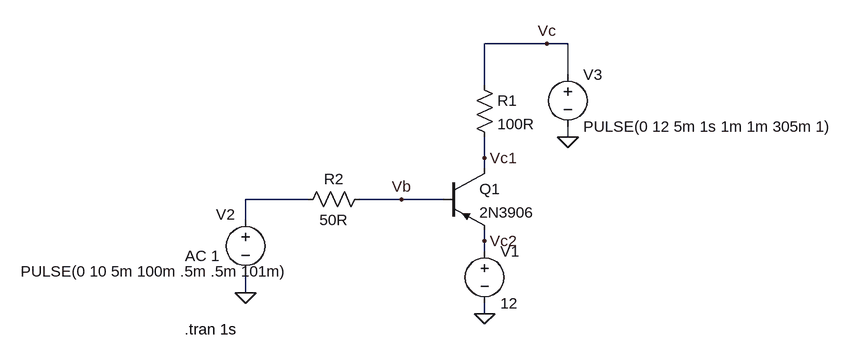
[diagram p0: schematic PNP Model.asc]
PNP Model.asc, the LTspice schematic file:
Version 4
SHEET 1 1068 680
WIRE 432 -192 336 -192
WIRE 464 -192 432 -192
WIRE 464 -144 464 -192
WIRE 336 -128 336 -192
WIRE 464 -48 464 -64
WIRE 336 -16 336 -48
WIRE 336 0 336 -16
WIRE 64 48 -32 48
WIRE 208 48 144 48
WIRE 272 48 208 48
WIRE -32 80 -32 48
WIRE 336 112 336 96
WIRE 336 128 336 112
WIRE -32 192 -32 160
WIRE 336 224 336 208
FLAG -32 192 0
FLAG 336 224 0
FLAG 464 -48 0
FLAG 208 48 Vb
FLAG 432 -192 Vc
FLAG 336 -16 Vc1
FLAG 336 112 Vc2
SYMBOL voltage 336 112 R0
WINDOW 123 0 0 Left 2
WINDOW 39 0 0 Left 2
SYMATTR InstName V1
SYMATTR Value 12
SYMBOL res 320 -144 R0
SYMATTR InstName R1
SYMATTR Value 100R
SYMBOL voltage -32 64 R0
WINDOW 0 -45 7 Left 2
WINDOW 3 -346 95 Left 2
WINDOW 123 -93 71 Left 2
WINDOW 39 0 0 Left 2
SYMATTR InstName V2
SYMATTR Value PULSE(0 10 5m 100m .5m .5m 101m)
SYMATTR Value2 AC 1
SYMBOL pnp 272 0 R0
SYMATTR InstName Q1
SYMATTR Value 2N3906
SYMBOL voltage 464 -160 R0
WINDOW 123 0 0 Left 2
WINDOW 39 0 0 Left 2
SYMATTR InstName V3
SYMATTR Value PULSE(0 12 5m 1s 1m 1m 305m 1)
SYMBOL res 160 32 R90
WINDOW 0 0 56 VBottom 2
WINDOW 3 32 56 VTop 2
SYMATTR InstName R2
SYMATTR Value 50R
TEXT -126 248 Left 2 !.tran 1s

The netlist it stands for:
* PNP Model.asc
V1 Vc2 0 12
R1 Vc Vc1 100R
V2 N001 0 PULSE(0 10 5m 100m .5m .5m 101m) AC 1
Q1 Vc1 Vb Vc2 0 2N3906
V3 Vc 0 PULSE(0 12 5m 1s 1m 1m 305m 1)
R2 Vb N001 50R
.model NPN NPN
.model PNP PNP
.lib standard.bjt
.tran 1s
.backanno
.end